# Altium project IMU_Breakout.PrjPcb
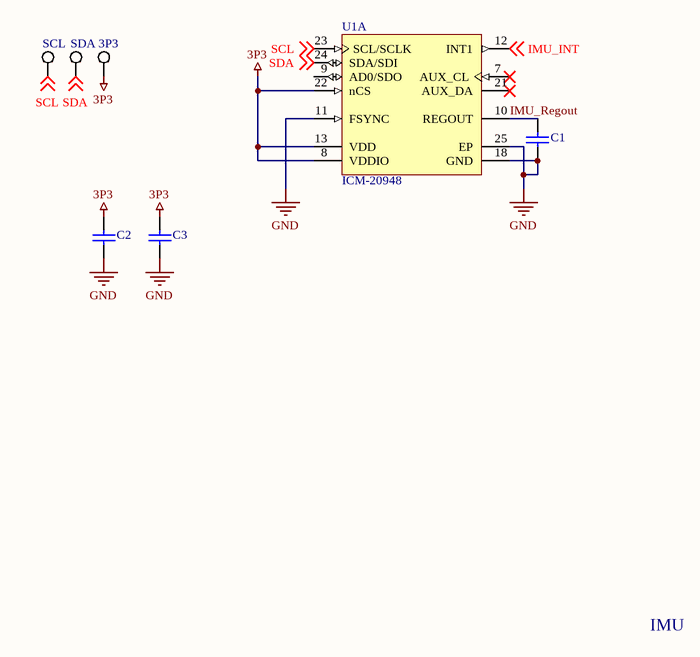
[diagram p0: IMU.SchDoc]
2 sheets, 8 parts. Net scope: global (net labels, ports and power ports of the same name join across sheets).
Board file: IMU_Breakout.PcbDoc
Sheets:
  IMU.SchDoc
  Connectors.SchDoc

## Sheet IMU.SchDoc
size A; SheetNumber: 1; SheetTotal: 2

### Parts
3P3  5019  [KSTN-5019_V]  (value not drawn)
C1  GRM21BR71H104KA01L  [CAPC2013X135X45ML10T25]  (value not drawn)
C2  GRM21BR71H104KA01L  [CAPC2013X135X45ML10T25]  (value not drawn)
C3  GRM21BR71H104KA01L  [CAPC2013X135X45ML10T25]  (value not drawn)
SCL  5019  [KSTN-5019_V]  (value not drawn)
SDA  5019  [KSTN-5019_V]  (value not drawn)
U1  ICM-20948  [TDK-QFN-24_L]  (part A of 2)

### Nets
3P3: 3P3.1 C2.2 C3.2 U1.8(VDDIO) U1.13(VDD) U1.22(nCS)
GND: C1.1 C2.1 C3.1 U1.11(FSYNC) U1.18(GND) U1.25(EP)
IMU_INT: U1.12(INT1) ; off-sheet IMU_INT
IMU_Regout: C1.2 U1.10(REGOUT)
SCL: SCL.1 U1.23(SCL/SCLK) ; off-sheet SCL
SDA: SDA.1 U1.24(SDA/SDI) ; off-sheet SDA

Not connected (* = marked no-connect by the designer): U1 7(AUX_CL)* 9(AD0/SDO) 21(AUX_DA)*

### Notes on the sheet
- IMU

### Library data of the parts
3P3 SCL SDA = CMP-1672-00008-1: Test Point, 1 Position SMD, RoHS, Tape and Reel; ComponentLink1Description: Manufacturer URL; Package Quantity: 1000; DatasheetVersion: 03/2014; Packaging: Tape and Reel; ComponentLink2URL: http://www.keyelco.com/product-pdf.cfm?p=1357; ComponentLink1URL: http://www.keyelco.com/; Mount: Surface Mount; Contact Plating: Silver; PackageDescription: 1-Pin Surface Mount Device, Body 3.81 x 2.03 mm; Pins: 1; RoHSCompliant: True; Mounting Technology: Surface Mount; ComponentLink2Description: Datasheet; PackageReference: 5019
C1-C3 = CMP-2100-03644-1: Chip Capacitor, 0.1 uF, +/- 10%, 50 V, -55 to 125 degC, 0805 (2012 Metric), RoHS, Tape and Reel; Manufacturer: Murata; Voltage: 50V; Capacitance: 100nF; Insulation Resistance: 10GR; Dielectric Material: Ceramic; Dielectric: X7R; Package Description: 2-Pin Surface Mount Device, Body 2 x 1.25 mm; Manufacturer URL: http://www.murata.com/; Case Code (Imperial): 0805; Datasheet URL: http://psearch.en.murata.com/capacitor/product/GRM21BR71H104KA01%23.pdf; Termination: SMD/SMT; Lead Free: LeadFree; Package Quantity: 1; Mount: SurfaceMount; REACH SVHC: Unknown; Thickness: 0.053inch; Height: 1.25mm; Case/Package: 0805; Voltage Rating: 50V; Width: 0.049inch; Case Code (Metric): 2012; Material: Ceramic; Min Operating Temperature: -55degC; RoHSCompliant: true; Datasheet Version: 42675.0; Voltage Rating (DC): 50V; Tolerance: 10%; Package Reference: 0805; Depth: 1.25mm; Length: 2mm; Max Operating Temperature: 125degC; Packaging: TapeandReel; Number of Pins: 2; Radiation Hardening: No
U1 = CMP-2000-07532-1: World’s Lowest Power 9-Axis MEMS MotionTracking(TM) Device, 1.71 to 3.6 V, -40 to 85 degC, 24-Pin QFN, RoHS, Tape and Reel; Manufacturer: TDK; Package Description: 24-Pin Quad Flat No-lead Package, Body 3 x 3 mm, Pitch 0.4 mm; Datasheet Version: Rev. 1.3, 06/2017; Package Reference: QFN-24; Mounting Technology: SurfaceMount; Datasheet URL: https://www.invensense.com/wp-content/uploads/2016/06/DS-000189-ICM-20948-v1.3.pdf; Manufacturer URL: http://www.tdk.com/

## Sheet Connectors.SchDoc
size A; SheetNumber: 2; SheetTotal: 2
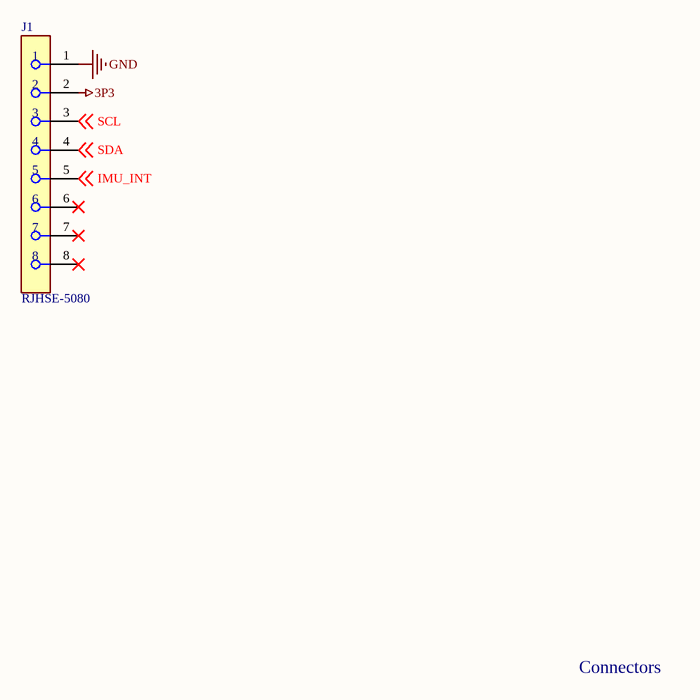
[diagram p1: Connectors.SchDoc]

### Parts
J1  RJHSE-5080  [FP-RJHSE-5080-MFG]

### Nets
3P3: J1.2
GND: J1.1
IMU_INT: J1.5 ; off-sheet IMU_INT
SCL: J1.3 ; off-sheet SCL
SDA: J1.4 ; off-sheet SDA

Not connected (* = marked no-connect by the designer): J1 6* 7* 8*

### Notes on the sheet
- Connectors

### Library data of the parts
J1 = CMP-02366-000003-1: CONN MOD JACK 8P8C R/A UNSHLD; Manufacturer: Amphenol; Current Rating: 1.5A; Voltage Rating: 125V; Pitch: 1.02mm; Conn Orientation: Right Angle; Number Of Contacts: 8; Is Female: yes; Conn Gender: Female; Lead Free: Yes; Device Class L3: unset; Footprint Url: https://cdn.amphenol-icc.com/media/wysiwyg/files/drawing/rjhse5080.pdf?__cf_chl_jschl_tk__=e349db0bbbb6188a39347cd5e541b92fa02c9719-1587748343-0-AW7tChdeHzRPLX9gSWj7WrKaXQoY9BsmT9Ek0h-T62M9y3Rs9iypFcOtkzb-6sGYQEjFE-jcoNciDETCOZrh1rYyOesac5SvYLoLwHIsHvF4AKBlx-MXmfZUVk9OTTJLqyQq2qMm0PFRLJpNcK0nrKResqOniRSYixG2sPTmOPraH-ULJFBDL602CHqcI9KKBgTq90Jh1OL2Td4moJ99rFsJRJ1Tk_uoxGe8ublcP_ARu-uLpWcQrBcwOcHDTAwL29DAwVaqcH7ta8Ks7WMlHmVl_pILeEDwT0bE9vu5Pa5S3PtNRF1leuFkgi_FMbUxTDulc5xzbXSfng8srUIV1lWXny5nx1fZJEUa_w97yKjffzBMxiWLWVN-V7-uqAaPbyv_m-wRyw5O25OZNyJOeGU; ComponentLink2URL: https://cdn.amphenol-icc.com/media/wysiwyg/files/documentation/datasheet/inputoutput/io-modjack-rjhse.pdf; Device Class L1: Connectors; Package: CONN_MOD_JACK; Mouser Description: Modular Connectors / Ethernet Connectors R/A RJ45 NONSHIELDED 8 CONT NO LEDS; Manufacturer Part Number: RJHSE-5080; Octopart: https://octopart.com/rjhse-5080-amphenol-45060; Category: Conn; Height: 0.535inch; Temperature: -55°C to +85°C; Digikey Description: CONN MOD JACK 8P8C R/A UNSHLD; Device Class L2: Modular / Ethernet Connectors; Contact Material: Gold,Nickel; ComponentLink2Description: Datasheet; Temperature Range Low: -55°C; RoHS: TRUE; Automotive: No; Temperature Range High: +85°C

## Nets that join several sheets
3P3: IMU (6 pins), Connectors (J1.2)
GND: IMU (6 pins), Connectors (J1.1)
IMU_INT: IMU (U1.12), Connectors (J1.5)
SCL: IMU (SCL.1 U1.23), Connectors (J1.3)
SDA: IMU (SDA.1 U1.24), Connectors (J1.4)